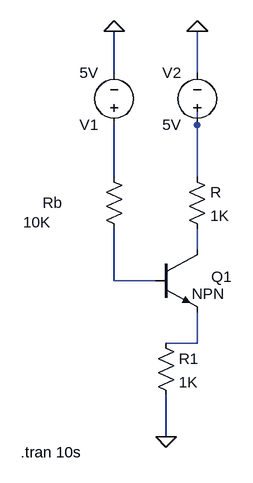
[diagram p0: schematic 2.asc]
2.asc, the LTspice schematic file:
Version 4
SHEET 1 880 680
WIRE 128 -176 128 -240
WIRE 256 -176 256 -240
WIRE 256 -96 256 -128
WIRE 128 -16 128 -96
WIRE 256 -16 256 -96
WIRE 256 96 256 64
WIRE 128 144 128 64
WIRE 192 144 128 144
WIRE 256 240 256 192
WIRE 256 240 208 240
WIRE 208 384 208 320
FLAG 208 384 0
FLAG 128 -240 0
FLAG 256 -240 0
SYMBOL npn 192 96 R0
WINDOW 0 86 42 Left 2
SYMATTR InstName Q1
SYMBOL res 240 -32 R0
SYMATTR InstName R
SYMATTR Value 1K
SYMBOL res 112 -32 R0
WINDOW 0 -94 56 Left 2
WINDOW 3 -124 86 Left 2
SYMATTR InstName Rb
SYMATTR Value 10K
SYMBOL res 192 224 R0
SYMATTR InstName R1
SYMATTR Value 1K
SYMBOL voltage 128 -80 R180
WINDOW 123 0 0 Left 0
WINDOW 39 0 0 Left 0
SYMATTR InstName V1
SYMATTR Value 5V
SYMBOL voltage 256 -80 R180
WINDOW 0 24 96 Left 2
WINDOW 3 24 16 Left 2
WINDOW 123 0 0 Left 0
WINDOW 39 0 0 Left 0
SYMATTR InstName V2
SYMATTR Value 5V
TEXT -16 408 Left 2 !.tran 10s

The netlist it stands for:
* 2.asc
Q1 N003 N004 N005 0 NPN
R N001 N003 1K
Rb N002 N004 10K
R1 N005 0 1K
V1 N002 0 5V
V2 N001 0 5V
.model NPN NPN
.model PNP PNP
.lib standard.bjt
.tran 10s
.backanno
.end